# EAGLE design darwin-integrated (EAGLE 9.5.0)
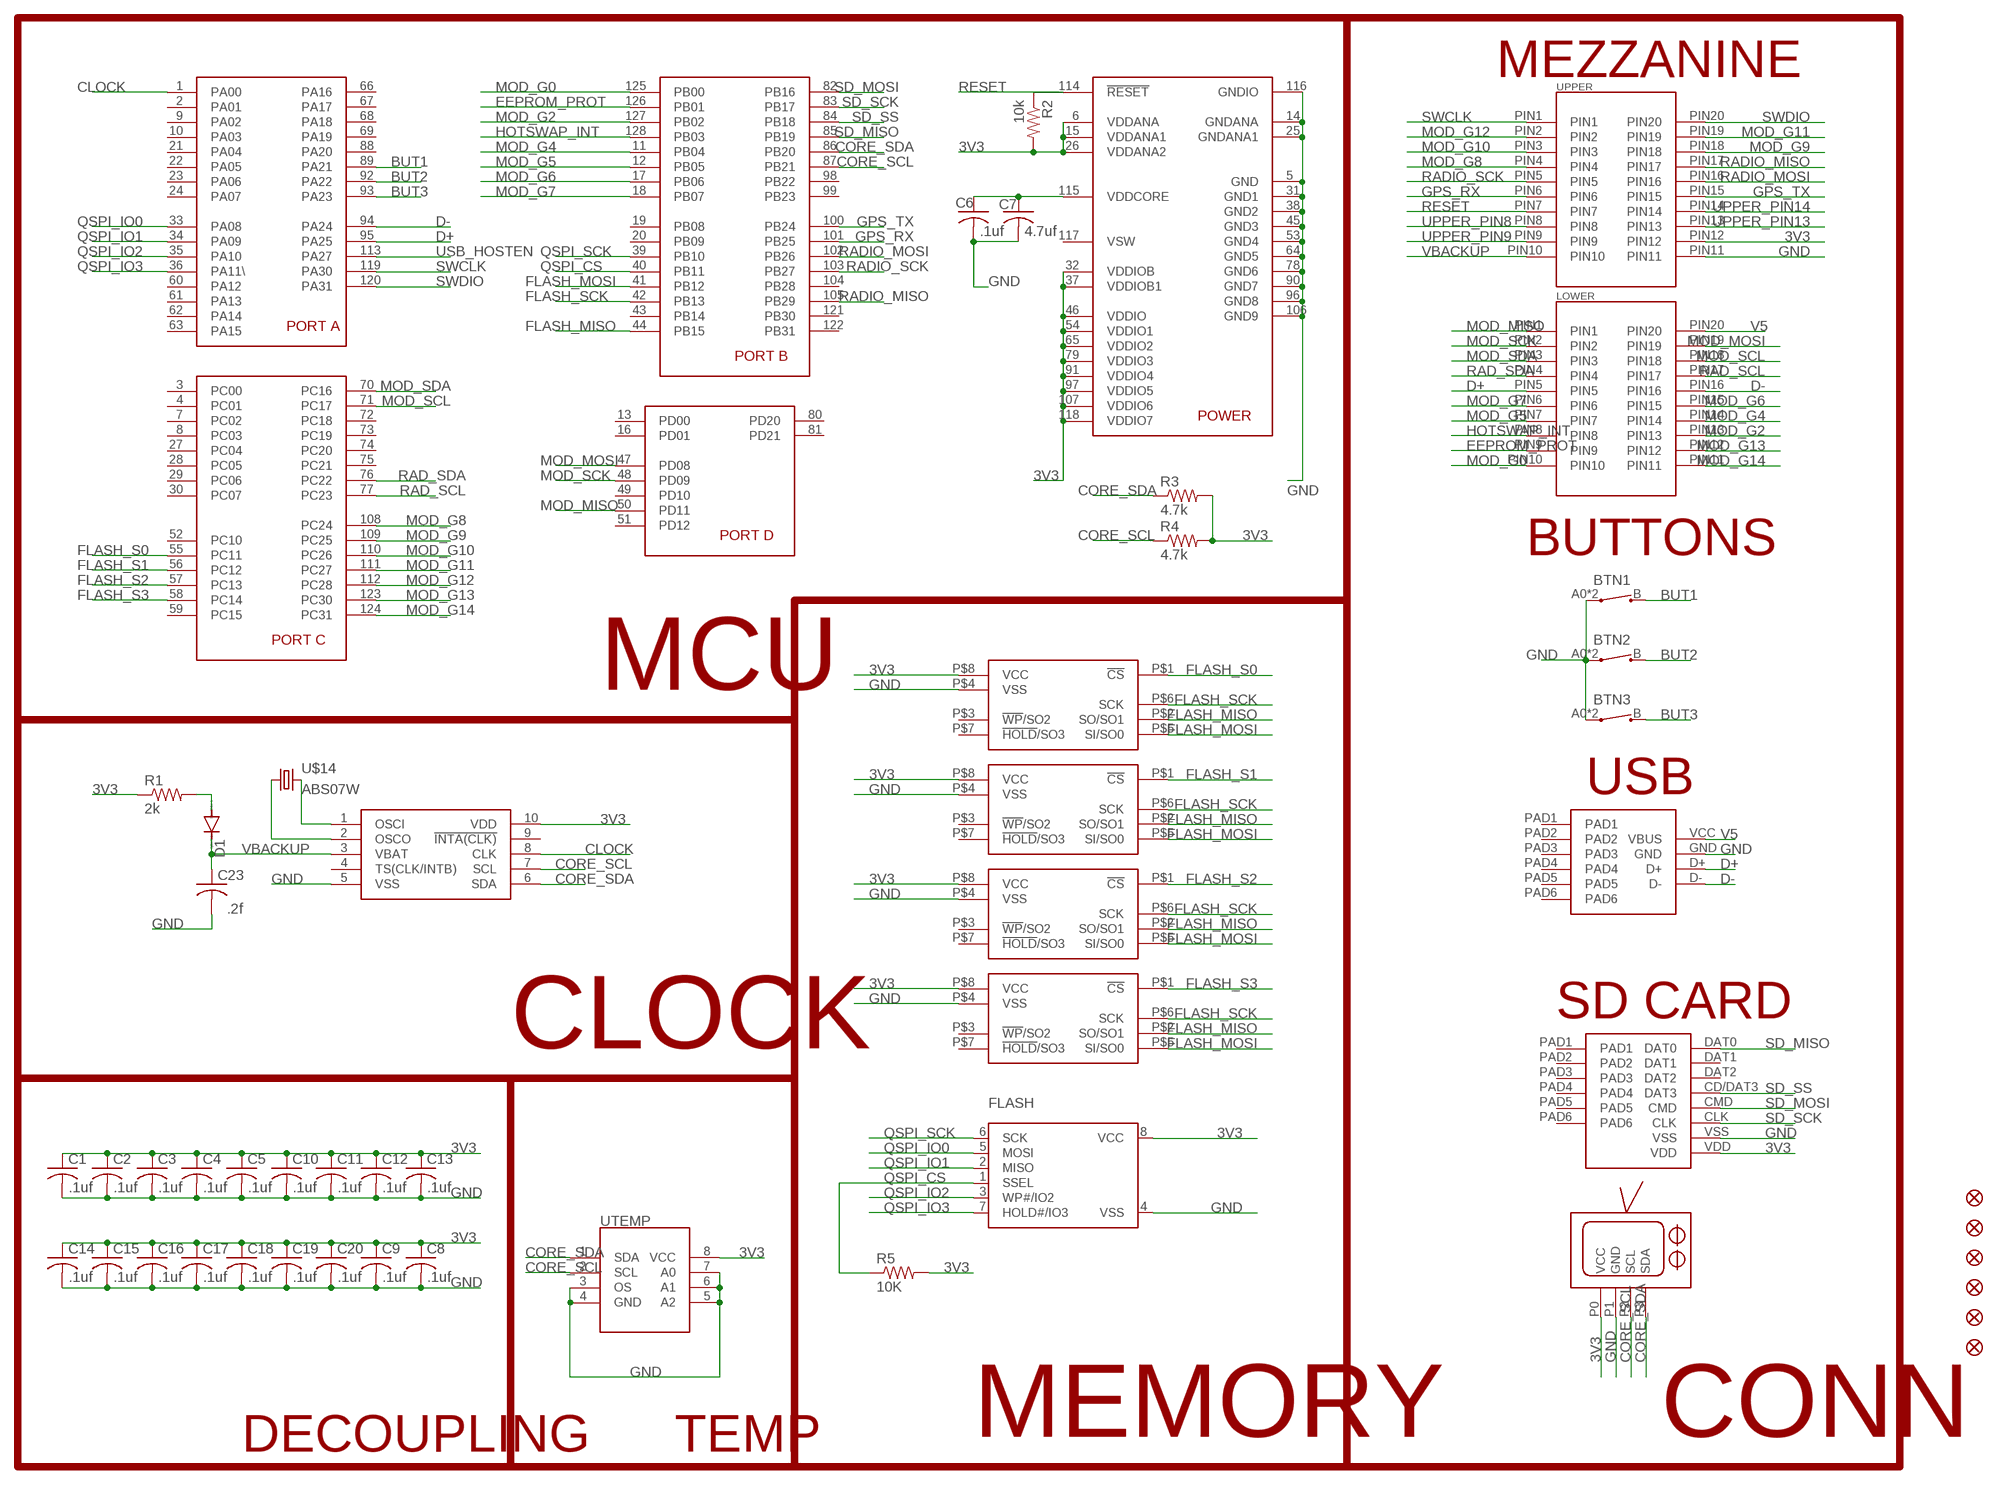
[diagram p0: schematic, sheet 1]

## Parts
BRAIN  SAMD51PXXA  [SQFP-S-14X14-128]
BTN1  EVP-AEJB2A  [EVP-AEJB2A]
BTN2  EVP-AEJB2A  [EVP-AEJB2A]
BTN3  EVP-AEJB2A  [EVP-AEJB2A]
C1  .1uf  C-USC0603K  [C0603K]
C2  .1uf  C-USC0603K  [C0603K]
C3  .1uf  C-USC0603K  [C0603K]
C4  .1uf  C-USC0603K  [C0603K]
C5  .1uf  C-USC0603K  [C0603K]
C6  .1uf  C-USC0603K  [C0603K]
C7  4.7uf  C-USC0603K  [C0603K]
C8  .1uf  C-USC0603K  [C0603K]
C9  .1uf  C-USC0603K  [C0603K]
C10  .1uf  C-USC0603K  [C0603K]
C11  .1uf  C-USC0603K  [C0603K]
C12  .1uf  C-USC0603K  [C0603K]
C13  .1uf  C-USC0603K  [C0603K]
C14  .1uf  C-USC0603K  [C0603K]
C15  .1uf  C-USC0603K  [C0603K]
C16  .1uf  C-USC0603K  [C0603K]
C17  .1uf  C-USC0603K  [C0603K]
C18  .1uf  C-USC0603K  [C0603K]
C19  .1uf  C-USC0603K  [C0603K]
C20  .1uf  C-USC0603K  [C0603K]
C23  .2f  DSK-3R3H204T614-H2L  [SUPERCAP]
D1  VS-10BQ015HM3/5BT  DIODE-SMB  [SMB]
FID1  FIDUCIAL_1MM  [FIDUCIAL_1MM]
FID2  FIDUCIAL_1MM  [FIDUCIAL_1MM]
FID3  FIDUCIAL_1MM  [FIDUCIAL_1MM]
FID4  FIDUCIAL_1MM  [FIDUCIAL_1MM]
FID5  FIDUCIAL_1MM  [FIDUCIAL_1MM]
FID6  FIDUCIAL_1MM  [FIDUCIAL_1MM]
FLASH  SPIFLASH_SOIC8208MIL  [SOIC8_208MIL]
LOWER  MOLEX-15-91-2200F  [20PH-F]
R1  2k  R-US_R0603  [R0603]
R2  10k  R-US_R0603  [R0603]
R3  4.7k  R-US_R0603  [R0603]
R4  4.7k  R-US_R0603  [R0603]
R5  10K  R-US_R0603  [R0603]
RTC  PCF85363ATT  [SOP50P490X110-10]
SCREEN  SCREEN  [SCREEN]
SD  DM3D-SF  [DM3D-SF]
U1  TC58CVG1S3HRAIG  [WSON8]
U2  TC58CVG1S3HRAIG  [WSON8]
U3  TC58CVG1S3HRAIG  [WSON8]
U4  TC58CVG1S3HRAIG  [WSON8]
U$14  ABS07W  [ABS07W]
UPPER  MOLEX-15-91-2200F  [20PH-F]
USB  MOLEX-47491-0001  [MOELX-47491-0001]
UTEMP  PCT2075  [SO8]

## Nets
3V3: BRAIN.6(VDDANA) BRAIN.15(VDDANA1) BRAIN.26(VDDANA2) BRAIN.32(VDDIOB) BRAIN.37(VDDIOB1) BRAIN.46(VDDIO) BRAIN.54(VDDIO1) BRAIN.65(VDDIO2) BRAIN.79(VDDIO3) BRAIN.91(VDDIO4) BRAIN.97(VDDIO5) BRAIN.107(VDDIO6) BRAIN.118(VDDIO7) C1.1 C2.1 C3.1 C4.1 C5.1 C8.1 C9.1 C10.1 C11.1 C12.1 C13.1 C14.1 C15.1 C16.1 C17.1 C18.1 C19.1 C20.1 FLASH.8(VCC) R1.1 R2.2 R3.2 R4.2 R5.2 RTC.10(VDD) SCREEN.P0(VCC) SD.VDD U1.P$8(VCC) U2.P$8(VCC) U3.P$8(VCC) U4.P$8(VCC) UPPER.PIN12 UTEMP.8(VCC)
BUT1: BRAIN.89(PA21) BTN1.B
BUT2: BRAIN.92(PA22) BTN2.B
BUT3: BRAIN.93(PA23) BTN3.B
CLOCK: BRAIN.1(PA00) RTC.8(CLK)
CORE_SCL: BRAIN.87(PB21) R4.1 RTC.7(SCL) SCREEN.P2(SCL) UTEMP.2(SCL)
CORE_SDA: BRAIN.86(PB20) R3.1 RTC.6(SDA) SCREEN.P3(SDA) UTEMP.1(SDA)
D+: BRAIN.95(PA25) LOWER.PIN5 USB.D+
D-: BRAIN.94(PA24) LOWER.PIN16 USB.D-
EEPROM_PROT: BRAIN.126(PB01) LOWER.PIN9
FLASH_MISO: BRAIN.44(PB15) U1.P$2(SO/SO1) U2.P$2(SO/SO1) U3.P$2(SO/SO1) U4.P$2(SO/SO1)
FLASH_MOSI: BRAIN.41(PB12) U1.P$5(SI/SO0) U2.P$5(SI/SO0) U3.P$5(SI/SO0) U4.P$5(SI/SO0)
FLASH_S0: BRAIN.55(PC11) U1.P$1(!CS)
FLASH_S1: BRAIN.56(PC12) U2.P$1(!CS)
FLASH_S2: BRAIN.57(PC13) U3.P$1(!CS)
FLASH_S3: BRAIN.58(PC14) U4.P$1(!CS)
FLASH_SCK: BRAIN.42(PB13) U1.P$6(SCK) U2.P$6(SCK) U3.P$6(SCK) U4.P$6(SCK)
GND: BRAIN.5(GND) BRAIN.14(GNDANA) BRAIN.25(GNDANA1) BRAIN.31(GND1) BRAIN.38(GND2) BRAIN.45(GND3) BRAIN.53(GND4) BRAIN.64(GND5) BRAIN.78(GND6) BRAIN.90(GND7) BRAIN.96(GND8) BRAIN.106(GND9) BRAIN.116(GNDIO) BTN1.A0 BTN1.A1 BTN2.A0 BTN2.A1 BTN3.A0 BTN3.A1 C1.2 C2.2 C3.2 C4.2 C5.2 C6.2 C7.2 C8.2 C9.2 C10.2 C11.2 C12.2 C13.2 C14.2 C15.2 C16.2 C17.2 C18.2 C19.2 C20.2 C23.- FLASH.4(VSS) RTC.5(VSS) SCREEN.P1(GND) SD.VSS U1.P$4(VSS) U2.P$4(VSS) U3.P$4(VSS) U4.P$4(VSS) UPPER.PIN11 USB.GND UTEMP.3(OS) UTEMP.4(GND) UTEMP.5(A2) UTEMP.6(A1) UTEMP.7(A0)
GPS_RX: BRAIN.101(PB25) UPPER.PIN6
GPS_TX: BRAIN.100(PB24) UPPER.PIN15
HOTSWAP_INT: BRAIN.128(PB03) LOWER.PIN8
MOD_G0: BRAIN.125(PB00) LOWER.PIN10
MOD_G2: BRAIN.127(PB02) LOWER.PIN13
MOD_G4: BRAIN.11(PB04) LOWER.PIN14
MOD_G5: BRAIN.12(PB05) LOWER.PIN7
MOD_G6: BRAIN.17(PB06) LOWER.PIN15
MOD_G7: BRAIN.18(PB07) LOWER.PIN6
MOD_G8: BRAIN.108(PC24) UPPER.PIN4
MOD_G9: BRAIN.109(PC25) UPPER.PIN18
MOD_G10: BRAIN.110(PC26) UPPER.PIN3
MOD_G11: BRAIN.111(PC27) UPPER.PIN19
MOD_G12: BRAIN.112(PC28) UPPER.PIN2
MOD_G13: BRAIN.123(PC30) LOWER.PIN12
MOD_G14: BRAIN.124(PC31) LOWER.PIN11
MOD_MISO: BRAIN.50(PD11) LOWER.PIN1
MOD_MOSI: BRAIN.47(PD08) LOWER.PIN19
MOD_SCK: BRAIN.48(PD09) LOWER.PIN2
MOD_SCL: BRAIN.71(PC17) LOWER.PIN18
MOD_SDA: BRAIN.70(PC16) LOWER.PIN3
N$2: D1.A R1.2
N$3: RTC.1(OSCI) U$14.P$2
N$4: RTC.2(OSCO) U$14.P$1
N$6: BRAIN.115(VDDCORE) C6.1 C7.1
QSPI_CS: BRAIN.40(PB11) FLASH.1(SSEL) R5.1
QSPI_IO0: BRAIN.33(PA08) FLASH.5(MOSI)
QSPI_IO1: BRAIN.34(PA09) FLASH.2(MISO)
QSPI_IO2: BRAIN.35(PA10) FLASH.3(WP#/IO2)
QSPI_IO3: BRAIN.36(PA11\) FLASH.7(HOLD#/IO3)
QSPI_SCK: BRAIN.39(PB10) FLASH.6(SCK)
RAD_SCL: BRAIN.77(PC23) LOWER.PIN17
RAD_SDA: BRAIN.76(PC22) LOWER.PIN4
RADIO_MISO: BRAIN.105(PB29) UPPER.PIN17
RADIO_MOSI: BRAIN.102(PB26) UPPER.PIN16
RADIO_SCK: BRAIN.103(PB27) UPPER.PIN5
RESET: BRAIN.114(!RESET) R2.1 UPPER.PIN7
SD_MISO: BRAIN.85(PB19) SD.DAT0
SD_MOSI: BRAIN.82(PB16) SD.CMD
SD_SCK: BRAIN.83(PB17) SD.CLK
SD_SS: BRAIN.84(PB18) SD.CD/DAT3(DAT3)
SWCLK: BRAIN.119(PA30) UPPER.PIN1
SWDIO: BRAIN.120(PA31) UPPER.PIN20
UPPER_PIN8: UPPER.PIN8
UPPER_PIN9: UPPER.PIN9
UPPER_PIN13: UPPER.PIN13
UPPER_PIN14: UPPER.PIN14
USB_HOSTEN: BRAIN.113(PA27)
V5: LOWER.PIN20 USB.VCC(VBUS)
VBACKUP: C23.+ D1.C RTC.3(VBAT) UPPER.PIN10
Unconnected: BRAIN.2(PA01) BRAIN.3(PC00) BRAIN.4(PC01) BRAIN.7(PC02) BRAIN.8(PC03) BRAIN.9(PA02) BRAIN.10(PA03) BRAIN.13(PD00) BRAIN.16(PD01) BRAIN.19(PB08) BRAIN.20(PB09) BRAIN.21(PA04) BRAIN.22(PA05) BRAIN.23(PA06) BRAIN.24(PA07) BRAIN.27(PC04) BRAIN.28(PC05) BRAIN.29(PC06) BRAIN.30(PC07) BRAIN.43(PB14) BRAIN.49(PD10) BRAIN.51(PD12) BRAIN.52(PC10) BRAIN.59(PC15) BRAIN.60(PA12) BRAIN.61(PA13) BRAIN.62(PA14) BRAIN.63(PA15) BRAIN.66(PA16) BRAIN.67(PA17) BRAIN.68(PA18) BRAIN.69(PA19) BRAIN.72(PC18) BRAIN.73(PC19) BRAIN.74(PC20) BRAIN.75(PC21) BRAIN.80(PD20) BRAIN.81(PD21) BRAIN.88(PA20) BRAIN.98(PB22) BRAIN.99(PB23) BRAIN.104(PB28) BRAIN.117(VSW) BRAIN.121(PB30) BRAIN.122(PB31) RTC.4(TS(CLK/INTB)) RTC.9(!INTA(CLK)) SD.DAT1 SD.DAT2 SD.PAD1 SD.PAD2 SD.PAD3 SD.PAD4 SD.PAD5 SD.PAD6 U1.P$3(!WP!/SO2) U1.P$7(!HOLD!/SO3) U2.P$3(!WP!/SO2) U2.P$7(!HOLD!/SO3) U3.P$3(!WP!/SO2) U3.P$7(!HOLD!/SO3) U4.P$3(!WP!/SO2) U4.P$7(!HOLD!/SO3) USB.PAD1 USB.PAD2 USB.PAD3 USB.PAD4 USB.PAD5 USB.PAD6

## Notes on the sheet
- MEZZANINE
- BUTTONS
- MCU
- USB
- .2f
- SD CARD
- CLOCK
- DECOUPLING | TEMP | MEMORY | CONN

## Library data of the parts
BRAIN = microbuilder:SAMD51PXXA: SAMD51 P variant
BTN1-BTN3 = Conservify:EVP-AEJB2A
C1-C20 = rcl:C-US: CAPACITOR, American symbol; SPICEPREFIX: C
C23 = Conservify:DSK-3R3H204T614-H2L
D1 = diode:DIODE-: DIODE
FID1-FID6 = microbuilder:FIDUCIAL: Fiducial Alignment Points Various fiducial points for machine vision alignment.; BOM: EXCLUDE
FLASH = microbuilder:SPIFLASH_SOIC8: SOIC8 SPI Flash Be careful with the size since SOIC8 flash comes in several 'widths' SOIC8 150 mil M25P16 - 16Mbit (2Mbit x 8) Serial Flash (75MHz SPI Bus), Supply: 2.7-3.6V Digikey: SOIC8 - M25P16-VMN6P-ND SOIC8 208 mil W25Q16BVSSIG - 16Mbit (2Mbit x 8) Serial Flash (104MHz SPI Bus), Supply: 2.7-3.6V Digikey: SOIC8 - W25Q16BVSSIG-ND
LOWER UPPER = Conservify:MOLEX-15-91-2200
R1-R5 = rcl:R-US_: RESISTOR, American symbol; SPICEPREFIX: R
RTC = Conservify:PCF85363ATT
SCREEN = Conservify:SCREEN
SD = Conservify:DM3D-SF
U1-U4 = Conservify:TC58CVG1S3HRAIG: Serial Interface NAND
U$14 = Conservify:ABS07W
USB = Conservify:MOLEX-47491-0001
UTEMP = Conservify:PCT2075

## Board
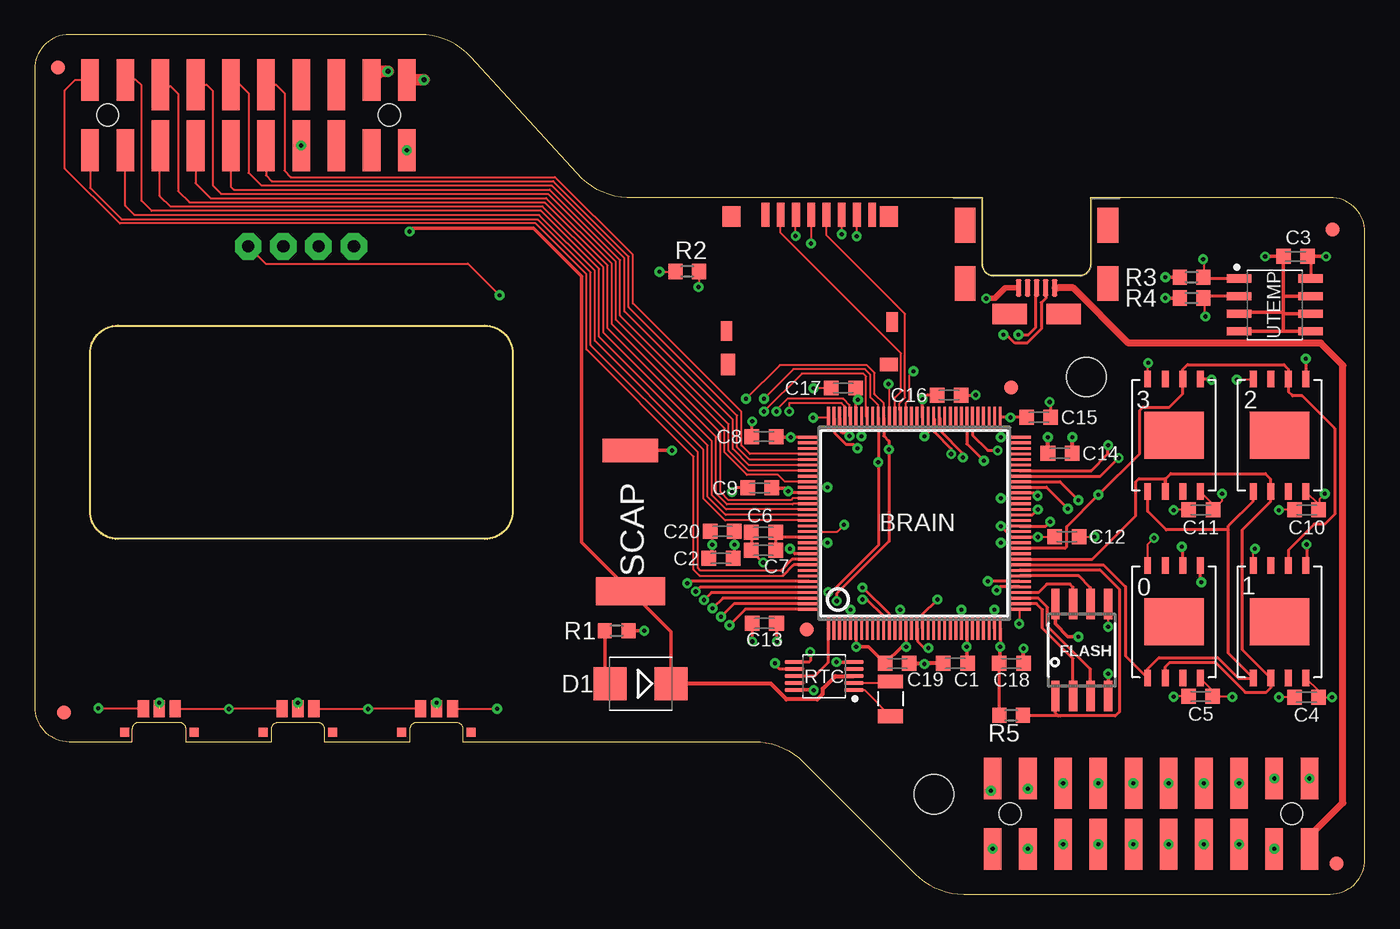
[diagram p1: board, top side]
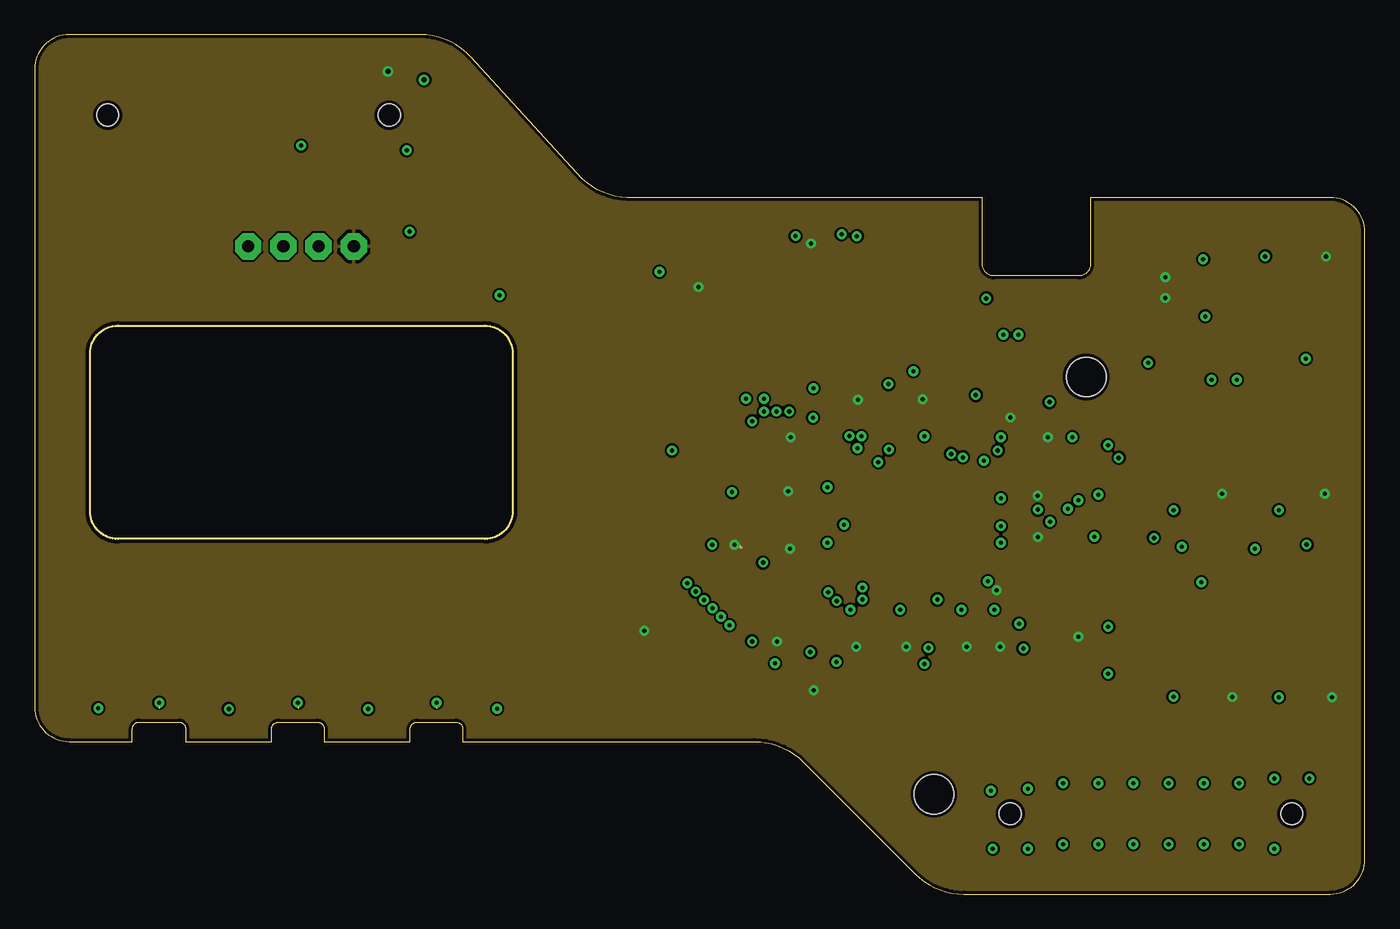
[diagram p2: board, inner layer PWR]
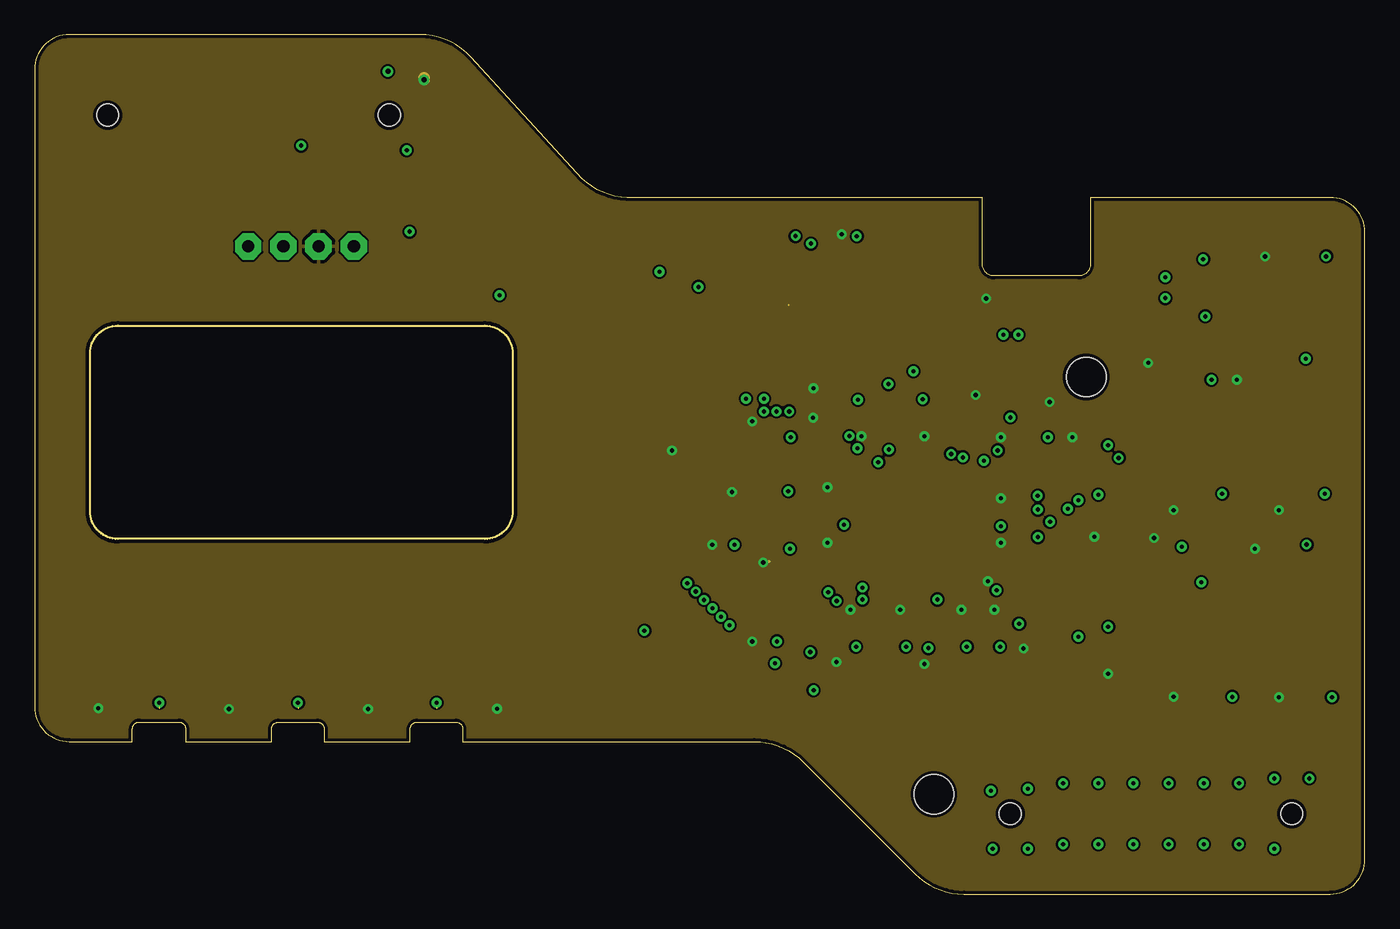
[diagram p3: board, inner layer GND]
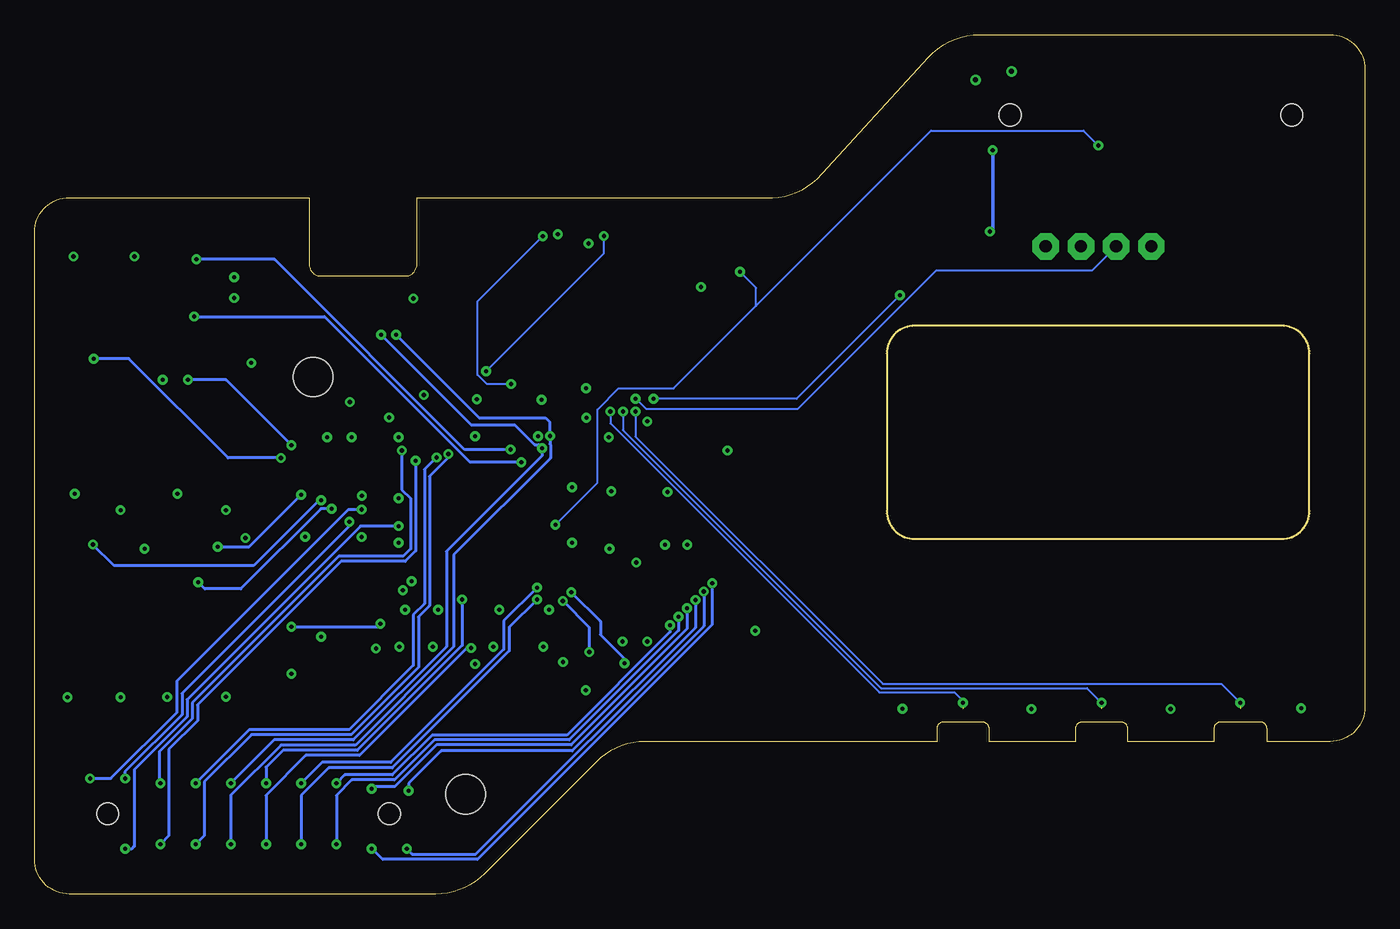
[diagram p4: board, bottom side, seen from below]

Size 96 x 62 mm. Coordinates in mm from the lower left corner, seen from the top.
Outline: 0,59.5 0,13.5 arc90 2.5,11 7.06,11 7.06,11.91 arc-90 7.56,12.41 10.4,12.41 arc-90 10.9,11.91 10.9,11 17.1,11 17.1,11.9 arc-90 17.6,12.4 20.4,12.4 arc-90 20.9,11.9 20.9,11 27.1,11 27.1,11.9 arc-90 27.6,12.4 30.4,12.4 arc-90 30.9,11.9 30.9,11 51.93,11 arc-45 55.46,9.54 63.54,1.46 arc45 67.07,0 93.5,0 arc90 96,2.5 96,47.75 arc90 93.5,50.25 76.22,50.23 76.19,50.23 76.19,45.44 arc-90 75.34,44.59 69.25,44.59 arc-90 68.4,45.44 68.4,50.25 43.2,50.25 arc-47 39.51,51.62 31.49,60.38 arc47 27.8,62 2.5,62 arc90 0,59.5
Outline: 32.5,41 arc-90 34.5,39 34.5,27.62 arc-90 32.5,25.62 6,25.62 arc-90 4,27.62 4,39 arc-90 6,41 32.5,41
Copper layers (1+2*15+16): Top 0.035mm / dielectric 1.5mm / PWR 0.035mm / dielectric 0.15mm / GND 0.035mm / dielectric 0.2mm / Bottom 0.035mm
Design rules "default *": minimum track width 6mil, minimum drill 0.3mm, track to track 6mil, track to pad 6mil, pad to pad 6mil, via to via 6mil, smd to smd 6mil, copper to edge 10mil, drill to drill 6mil, minimum pad ring 10mil, minimum via ring 8mil, stop-mask expansion 4mil, vias tented up to drill 0.31mm, thermal gap 10mil
Holes 2.84 mm at 75.9,37.3 64.9,7.2

### Footprints (pad centres in the part's own frame; a part is rotated, then mirrored left to right if it is on the bottom)
SQFP-S-14X14-128 = smd 0.2 x 1.6: 1 -6.2,-7.6; 2 -5.8,-7.6; 3 -5.4,-7.6; 4 -5,-7.6; 5 -4.6,-7.6; 6 -4.2,-7.6; 7 -3.8,-7.6; 8 -3.4,-7.6; 9 -3,-7.6; 10 -2.6,-7.6; 11 -2.2,-7.6; 12 -1.8,-7.6; 13 -1.4,-7.6; 14 -1,-7.6; 15 -0.6,-7.6; 16 -0.2,-7.6; 17 0.2,-7.6; 18 0.6,-7.6; 19 1,-7.6; 20 1.4,-7.6; 21 1.8,-7.6; 22 2.2,-7.6; 23 2.6,-7.6; 24 3,-7.6; 25 3.4,-7.6; 26 3.8,-7.6; 27 4.2,-7.6; 28 4.6,-7.6; 29 5,-7.6; 30 5.4,-7.6; 31 5.8,-7.6; 32 6.2,-7.6; 65 6.2,7.6; 66 5.8,7.6; 67 5.4,7.6; 68 5,7.6; 69 4.6,7.6; 70 4.2,7.6; 71 3.8,7.6; 72 3.4,7.6; 73 3,7.6; 74 2.6,7.6; 75 2.2,7.6; 76 1.8,7.6; 77 1.4,7.6; 78 1,7.6; 79 0.6,7.6; 80 0.2,7.6; 81 -0.2,7.6; 82 -0.6,7.6; 83 -1,7.6; 84 -1.4,7.6; 85 -1.8,7.6; 86 -2.2,7.6; 87 -2.6,7.6; 88 -3,7.6; 89 -3.4,7.6; 90 -3.8,7.6; 91 -4.2,7.6; 92 -4.6,7.6; 93 -5,7.6; 94 -5.4,7.6; 95 -5.8,7.6; 96 -6.2,7.6 | smd 1.6 x 0.2: 33 7.6,-6.2; 34 7.6,-5.8; 35 7.6,-5.4; 36 7.6,-5; 37 7.6,-4.6; 38 7.6,-4.2; 39 7.6,-3.8; 40 7.6,-3.4; 41 7.6,-3; 42 7.6,-2.6; 43 7.6,-2.2; 44 7.6,-1.8; 45 7.6,-1.4; 46 7.6,-1; 47 7.6,-0.6; 48 7.6,-0.2; 49 7.6,0.2; 50 7.6,0.6; 51 7.6,1; 52 7.6,1.4; 53 7.6,1.8; 54 7.6,2.2; 55 7.6,2.6; 56 7.6,3; 57 7.6,3.4; 58 7.6,3.8; 59 7.6,4.2; 60 7.6,4.6; 61 7.6,5; 62 7.6,5.4; 63 7.6,5.8; 64 7.6,6.2; 97 -7.6,6.2; 98 -7.6,5.8; 99 -7.6,5.4; 100 -7.6,5; 101 -7.6,4.6; 102 -7.6,4.2; 103 -7.6,3.8; 104 -7.6,3.4; 105 -7.6,3; 106 -7.6,2.6; 107 -7.6,2.2; 108 -7.6,1.8; 109 -7.6,1.4; 110 -7.6,1; 111 -7.6,0.6; 112 -7.6,0.2; 113 -7.6,-0.2; 114 -7.6,-0.6; 115 -7.6,-1; 116 -7.6,-1.4; 117 -7.6,-1.8; 118 -7.6,-2.2; 119 -7.6,-2.6; 120 -7.6,-3; 121 -7.6,-3.4; 122 -7.6,-3.8; 123 -7.6,-4.2; 124 -7.6,-4.6; 125 -7.6,-5; 126 -7.6,-5.4; 127 -7.6,-5.8; 128 -7.6,-6.2
EVP-AEJB2A = smd 0.8 x 1.25: A0 -1.15,2.375; A1 1.15,2.375; B 0,2.375 | smd 0.65 x 0.65: PAD -2.5,0.675; PAD1 2.5,0.675
C0603K = smd 1.05 x 1.08: 1 -0.875,0; 2 0.875,0
SUPERCAP = smd 5 x 2: + 0,5.15 | smd 4 x 1.7: - 0,-5
SMB = smd 2.4 x 2.4: A 2.2,0; C -2.2,0
FIDUCIAL_1MM = smd 1 x 1: 1 0,0
SOIC8_208MIL = smd 0.6 x 2.2: 1 -1.905,-3.315; 2 -0.635,-3.315; 3 0.635,-3.315; 4 1.905,-3.315; 5 1.905,3.315; 6 0.635,3.315; 7 -0.635,3.315; 8 -1.905,3.315
20PH-F = smd 3 x 1.27: PIN1 -0.34,0; PIN2 -0.34,-2.54; PIN9 -0.34,-20.32; PIN10 -0.34,-22.86; PIN11 4.74,-22.86; PIN12 4.74,-20.32; PIN19 4.74,-2.54; PIN20 4.74,0 | smd 3.68 x 1.27: PIN3 0,-5.08; PIN4 0,-7.62; PIN5 0,-10.16; PIN6 0,-12.7; PIN7 0,-15.24; PIN8 0,-17.78; PIN13 4.4,-17.78; PIN14 4.4,-15.24; PIN15 4.4,-12.7; PIN16 4.4,-10.16; PIN17 4.4,-7.62; PIN18 4.4,-5.08 | hole 1.58: 2.2,-1.27; 2.2,-21.59
R0603 = smd 1 x 1.1: 1 -0.85,0; 2 0.85,0
SOP50P490X110-10 = smd 1.438 x 0.297: 1 -2.145,1; 2 -2.145,0.5; 3 -2.145,0; 4 -2.145,-0.5; 5 -2.145,-1; 6 2.145,-1; 7 2.145,-0.5; 8 2.145,0; 9 2.145,0.5; 10 2.145,1
SCREEN = drill 0.889 pad 1.905 octagon: P0 13.97,1.27; P1 16.51,1.27; P2 19.05,1.27; P3 21.59,1.27
DM3D-SF = smd 0.55 x 1.75: CD/DAT3 6.6,-0.875; CLK 3.3,-0.875; CMD 5.5,-0.875; DAT0 1.1,-0.875; DAT1 0,-0.875; DAT2 7.7,-0.875; VDD 4.4,-0.875; VSS 2.2,-0.875 | smd 1.3 x 1.5: PAD1 -1.2,-0.75; PAD2 10.15,-0.75 | smd 0.8 x 1.4: PAD3 10.5,7.5; PAD6 -1.45,6.85 | smd 1 x 1.55: PAD4 10.4,9.925 | smd 1.3 x 1: PAD5 -1.2,9.925
WSON8 = smd 0.5 x 1.2: P$1 -1.905,-4.06; P$2 -0.635,-4.06; P$3 0.635,-4.06; P$4 1.905,-4.06; P$5 1.905,4.06; P$6 0.635,4.06; P$7 -0.635,4.06; P$8 -1.905,4.06 | smd 4.3 x 3.4: PAD 0,0
ABS07W = smd 1 x 1.8: P$1 -1.25,0; P$2 1.25,0
MOELX-47491-0001 = smd 1.25 x 0.4: D+ 0.875,0; D- 0.875,0.65; GND 0.875,-1.3; ID 0.875,-0.65; VCC 0.875,1.3 | smd 2.5 x 1.5: PAD1 -3.65,5.15; PAD2 0.55,5.15; PAD5 0.55,-5.15; PAD6 -3.65,-5.15 | smd 1.5 x 2.5: PAD3 2.75,1.95; PAD4 2.75,-1.95
SO8 = smd 1.746 x 0.592: 1 -2.585,1.905; 2 -2.585,0.635; 3 -2.585,-0.635; 4 -2.585,-1.905; 5 2.585,-1.905; 6 2.585,-0.635; 7 2.585,0.635; 8 2.585,1.905

### Placement (x,y rotation side)
BRAIN  63.48,26.75 0 top
BTN1  9,11 0 top
BTN2  19,11 0 top
BTN3  29,11 0 top
C1  66.46,16.66 180 top
C2  49.53,24.22 180 top
C3  91,46 180 top
C4  91.79,14.2 180 top
C5  84.15,14.26 180 top
C6  52.6,26.1 180 top
C7  52.6,24.8 180 top
C8  52.63,33 180 top
C9  52.33,29.3 180 top
C10  91.8,27.72 180 top
C11  84.16,27.72 180 top
C12  74.5,25.78 0 top
C13  52.66,19.54 180 top
C14  74,31.8 0 top
C15  72.46,34.4 0 top
C16  66,36 0 top
C17  58.37,36.51 180 top
C18  70.49,16.64 0 top
C19  62.25,16.64 0 top
C20  49.63,26.17 180 top
C23  43,27 180 top
D1  43.73,15.18 180 top
FID1  2.13,13.11 0 top
FID2  1.69,59.64 0 top
FID3  93.66,47.93 0 top
FID4  93.94,2.2 0 top
FID5  70.47,36.53 0 top
FID6  55.71,19.08 0 top
FLASH  75.57,17.61 0 top
LOWER  92,8 270 top
R1  42,19 180 top
R2  47.1,44.92 0 top
R3  83.5,44.5 180 top
R4  83.5,43 180 top
R5  70.48,12.89 180 top
RTC  56.98,15.73 180 top
SCREEN  37,48 180 top
SD  60.44,48.13 180 top
U1  82.23,19.64 180 top
U2  89.85,19.64 180 top
U3  89.85,33.1 180 top
U4  82.23,33.1 180 top
U$14  61.77,14.09 270 top
UPPER  4,54 90 top
USB  72.31,44.6 270 top
UTEMP  89.5,42.5 0 top

### Tracks (layer width: path | path; a pad name or v marks a point on that pad's centre or on a via)
3V3  (via drill 0.3, 0.35)
  Top 0.152: C12.1 73.6,25.75 72.39,25.75 | UTEMP.8 92,44.32 | R2.2 47.95,43.85 v47.9,43.8 | v59.42,35.67 59.24,35.85 C17.1 | 85.12,27.8 C11.1 | 91.76,15.56 U2.P$8 92.66,14.66 C4.1 v93.63,14.2 | 84.22,15.48 U1.P$8 85.02,14.69 C5.1 86.4,14.26 v86.44,14.22 | U4.P$8 85.03,28.14 C11.1 | U3.P$8 92.67,28.12 92.67,27.65 C10.1 92.72,27.76 92.72,28.47 v93.11,28.87 | C11.1 85.7,28.38 v85.7,28.87 | SD.VDD 56.04,46.95 v56.02,46.93
  Top 0.2: R5.2 69.63,16.62 C18.1 | C3.1 92.08,45.79 UTEMP.8
  Top 0.203: BRAIN.97 54.59,32.95 | v54.57,32.95 v54.56,32.95 | BRAIN.107 54.5,28.95 v54.39,29.06 | BRAIN.91 59.28,35.53 | 59.28,35.53 59.28,35.66 | 59.28,35.53 v59.42,35.67 | BRAIN.79 v64.08,35.68 v64.09,35.69 64.4,36 C16.1 | BRAIN.54 72.18,28.95 v72.39,28.74 | v72.39,25.76 72.39,25.75 BRAIN.46 | BRAIN.37 69.65,22.15 v69.42,21.92 | BRAIN.32 v69.68,17.84 | v67.27,17.84 67.28,17.85 BRAIN.26 | 62.88,17.85 v62.9,17.84 62.9,19.13 BRAIN.15 | v59.29,17.84 59.28,17.84 BRAIN.6 | C15.1 70.44,34.4 v70.42,34.39 69.72,34.39 BRAIN.65 | C13.1 53.53,18.25 v53.56,18.22 | 50.54,24.05 C2.1 50.5,24.32 v50.5,25.2 C20.1 | BRAIN.118 54.86,24.55 v54.51,24.91
  Top 0.254: RTC.10 56.2,14.73 v56.22,14.71 | R1.1 v44,19 | FLASH.8 73.67,19.49 74.58,18.57 v75.32,18.57 | C8.1 53.56,32.95 v54.57,32.95 54.59,32.95 | C9.1 53.24,29.27 54.19,29.27 v54.39,29.06 | 59.28,17.84 60.17,17.84 C19.1 62.58,17.84 v62.9,17.84 | v67.27,17.84 67.27,16.72 C1.1 | v69.68,17.84 69.68,16.7 C18.1 | C15.1 71.32,34.13 | C3.1 v93.2,46 | R3.2 v81.6,44.5 | R4.2 v81.6,43
  Top 0.305: C14.1 v73.12,32.95
  Top 0.813: UPPER.PIN12 24.93,59.35 v25.5,59.35
  PWR 0.152: v47.9,43.8 v47.9,43.81 | v86.44,14.22 86.46,14.24 | v93.63,14.2 93.89,14.2 93.93,14.24 | v93.11,28.87 v93.12,28.87
  PWR 0.203: v54.51,24.91 54.61,25.01 | v50.5,25.2 50.8,25.2 51,25
  PWR 0.254: 93.16,45.94 93.2,45.98 v93.2,46 | v81.6,44.5 81.58,44.48 81.58,44.41 | v81.6,43 81.58,43.02 81.58,43.04
  pour PWR: -3,63 100,63 100,-1 -3,-1
BUT1  (via drill 0.3)  (1 unrouted)
  Top 0.152: BRAIN.89 60.01,34.42 60.01,37.35 59.81,37.55 55.38,37.55 v52.64,34.81 | v9,13.8 9,13.5
  Bottom 0.152: v52.64,34.81 52.64,33 34.8,15.15 10.35,15.15 v9,13.8
BUT2  (via drill 0.3)  (1 unrouted)
  Top 0.152: BRAIN.92 58.81,34.42 58.81,35.28 58.36,35.73 54.33,35.73 53.55,34.95 v53.55,34.81 | v19,13.79 19,13.49
  Bottom 0.152: v53.55,34.81 53.55,33.47 34.92,14.85 20.05,14.85 v19,13.79
BUT3  (via drill 0.3)  (1 unrouted)
  Top 0.152: BRAIN.93 58.46,34.37 58.46,35.2 58.23,35.42 54.45,35.42 v54.45,34.81 | v29,13.79 29,13.49
  Bottom 0.152: v54.45,34.81 54.45,33.95 35.05,14.54 30.83,14.54 | 30.83,14.54 30.68,14.54 | 30.83,14.54 | 30.83,14.54 29.61,14.54 | 29.61,14.54 | 29.61,14.54 29,13.93 v29,13.79
CLOCK
  Top 0.203: BRAIN.1 57.25,19.15 57.25,16.69 56.28,15.73 RTC.8
CORE_SCL  (via drill 0.3)
  Top 0.152: BRAIN.87 60.88,35.26 60.31,35.83 60.31,37.48 59.93,37.86 54.76,37.86 v52.63,35.73 | v84.48,41.67 84.44,41.71 84.44,43.09
  Top 0.2: UTEMP.2 84.48,43.13 84.44,43.09 R4.1
  Top 0.203: RTC.7 53.77,16.23 53.35,16.65 v53.44,16.65 | BRAIN.87 v60.88,31.16 60.88,25.16 57.5,21.78 v57.27,21.78
  Bottom 0.152: v52.63,35.73 52.59,35.73 51.89,35.02 40.9,35.02 30.92,45 19.68,45 SCREEN.P2
  Bottom 0.203: v57.27,21.78 55.17,19.68 55.17,18.72 53.44,16.98 v53.44,16.65 | v60.88,31.16 64.58,31.16 75.08,41.66 84.47,41.66 v84.48,41.67
CORE_SDA  (via drill 0.3)
  Top 0.152: v33.55,43.2 31.27,45.48 16.66,45.48 SCREEN.P3 | BRAIN.86 61.28,35.4 60.62,36.06 60.62,37.61 60.06,38.17 53.78,38.17 v51.34,35.73 | 61.66,32.22 v61.66,32.07 | v84.33,45.79 84.38,45.73 84.38,44.47
  Top 0.2: UTEMP.1 84.44,44.41 84.38,44.47 R3.1
  Top 0.203: RTC.6 55.89,16.73 55.98,16.82 v55.98,17.46 | BRAIN.86 61.28,33.05 61.66,32.67 61.66,32.22 | v61.66,32.07 61.66,25.44 57.88,21.66 v57.88,21.14
  Bottom 0.152: v33.55,43.2 41.02,35.73 v51.34,35.73
  Bottom 0.203: v57.88,21.14 55.98,19.24 v55.98,17.46 | v61.66,32.07 64.97,32.07 78.69,45.79 v84.33,45.79
D+  (via drill 0.3)
  Top 0.203: USB.D+ 72.23,43.65 72.23,40.86 71.69,40.32 71.02,40.32 v71,40.34 | BRAIN.95 57.72,34.31 57.72,33.27 58.56,32.44 59.1,32.44 v59.38,32.16
  Bottom 0.203: v71,40.34 64.5,33.85 61.35,33.85 59.92,32.42 59.63,32.42 v59.38,32.16 59.38,31.62 66.28,24.72 66.28,17.85 73,11.12 78.72,11.12 LOWER.PIN5
  other vias: 81.84,8
D-  (via drill 0.3)
  Top 0.203: USB.D- 72.97,42.98 72.65,42.66 72.65,40.78 71.61,39.74 70.75,39.74 70.14,40.34 v69.92,40.34 | BRAIN.94 58.13,34.3 58.13,33.45 58.27,33.3 58.56,33.3 v58.81,33.04
  Bottom 0.203: v69.92,40.34 63.92,34.34 59.13,34.34 58.81,34.02 v58.81,33.04 58.81,32.46 58.77,32.42 58.77,31.46 65.75,24.48 65.75,17.85 72.85,10.75 78.23,10.75 81.84,7.14 LOWER.PIN16
  other vias: 81.84,3.6
EEPROM_PROT  (via drill 0.3)
  Top 0.203: v48.92,20.61 49.66,21.35 BRAIN.126 | v71.68,7.6 LOWER.PIN9
  Bottom 0.203: v48.92,20.61 48.92,19.12 57.28,10.76 67,10.76 69.98,7.78 71.5,7.78 v71.68,7.6
FLASH_MISO  (via drill 0.3)
  Top 0.203: BRAIN.44 74.38,24.95 74.48,25.05 74.48,26.52 v76.77,28.81 79.75,31.78 79.75,34.9 79.98,35.13 81.9,35.13 82.86,36.09 U4.P$2 82.86,37.84 83.2,38.19 90.15,38.19 90.48,37.86 U3.P$2 90.48,36.25 90.78,35.94 91.48,35.94 93.82,33.6 93.82,27.4 93.11,26.68 92.35,26.68 90.48,24.82 U2.P$2 | U1.P$2 82.86,25 v82.8,25.06
  Bottom 0.203: v82.8,25.06 80.52,25.06 v76.77,28.81
FLASH_MOSI
  Top 0.203: BRAIN.41 77.14,23.75 78.72,22.17 78.72,17.18 U1.P$5 80.32,16.24 81.14,17.06 85.38,17.06 86.87,15.58 U2.P$5 86.15,17.36 86.15,26.28 | 86.15,26.28 81.66,26.28 80.32,27.62 U4.P$5 | 86.15,26.28 86.15,26.55 87.94,28.34 U3.P$5
FLASH_S0  (via drill 0.3)
  Top 0.203: BRAIN.55 73.03,29.35 v74.57,27.8 | v84.2,22.5 84.13,22.57 U1.P$1
  Bottom 0.203: v74.57,27.8 75.33,27.8 81.12,22.01 83.71,22.01 v84.2,22.5
FLASH_S1  (via drill 0.3)
  Top 0.203: BRAIN.56 74,29.75 v75.33,28.41 | v91.79,25.21 91.79,23.74 U2.P$1
  Bottom 0.203: v75.33,28.41 75.49,28.41 80.21,23.69 90.27,23.69 v91.79,25.21
FLASH_S2  (via drill 0.3)
  Top 0.203: BRAIN.57 76.92,30.15 v78.23,31.46 | v91.74,38.62 v91.75,38.61 U3.P$1
  Bottom 0.203: v78.23,31.46 82.04,31.46 89.2,38.62 v91.74,38.62
FLASH_S3  (via drill 0.3)
  Top 0.203: BRAIN.58 76.25,30.55 77.47,31.77 v77.47,32.38 | U4.P$1 84.88,37.16 v84.94,37.1
  Bottom 0.203: v77.47,32.38 82.19,37.1 v84.94,37.1
FLASH_SCK
  Top 0.203: BRAIN.42 76.32,24.15 79.46,27.29 79.46,29.73 79.69,29.97 81.59,29.97 U4.P$6 81.59,29.93 81.98,30.33 88.82,30.33 89.21,29.93 U3.P$6 89.21,28.34 87.16,26.29 87.16,17.63 U2.P$6 89.21,14.88 88.89,14.55 87.37,14.55 85.21,16.71 81.92,16.71 81.59,16.38 U1.P$6 81.72,15.45
GND  (via drill 0.3, 0.35)
  Top 0.152: C12.2 76.47,25.78 v76.48,25.77 | BTN1.A1 13.99,13.38 | 13.99,13.38 v14.02,13.35 | BTN2.A0 13.99,13.38 | BTN2.A1 24.05,13.38 | 24.05,13.38 v24.08,13.35 | BTN3.A0 24.05,13.38 | BTN3.A1 v33.37,13.38 | BRAIN.96 v56.19,34.35 v56.18,34.36 | BTN1.A0 4.62,13.38 v4.6,13.4 | C17.2 v56.21,36.51 v56.2,36.5 | U4.P$4 80.32,38.28 v80.36,38.32 | U3.P$4 87.88,37.1 v86.76,37.1 | U2.P$4 87.94,24.78 v88.07,24.91 | U1.P$4 80.32,25.23 v80.79,25.69 | C11.2 82.22,27.72 v82.2,27.7 | C10.2 89.82,27.72 v89.8,27.7 | C4.2 v89.8,14.2 | C5.2 82.21,14.26 v82.19,14.24 | SD.VSS v58.24,47.59
  Top 0.203: BRAIN.106 57.2,29.35 v57.21,29.34 | BRAIN.90 59.68,33.03 v59.67,33.02 | BRAIN.78 64.48,33.28 v64.22,33.02 | BRAIN.64 v69.73,32.95 | BRAIN.53 v69.73,28.55 | BRAIN.45 v69.73,25.35 | BRAIN.38 v68.8,22.55 v68.79,22.56 | BRAIN.31 v69.28,20.49 v69.27,20.5 | BRAIN.25 v66.88,20.5 | BRAIN.14 62.48,20.49 v62.46,20.5 | BRAIN.5 v58.88,20.5 | BRAIN.116 v57.2,25.35 v57.21,25.35 | C15.2 73.33,35.41 v73.25,35.49 | C16.2 v67.91,36 | C8.2 51.76,34.07 v51.78,34.1 | C9.2 50.63,29.3 v50.33,29 | v51.78,18.22 | C13.2 v51.78,18.22 | v52.58,23.91 51.73,24.77 C7.2 C6.2 | C2.2 48.9,24.47 v48.9,25.2 48.9,26.02 C20.2
  Top 0.254: RTC.5 57.89,16.73 v57.87,16.74 | v46,32 C23.- | FLASH.4 v77.47,15.9 | 90.12,43.2 C3.2 v88.8,46 | 90.12,43.2 90.12,41.98 | 90.12,41.98 90.12,41.8 | 90.12,41.8 90.12,40.61 | UTEMP.4 90.11,40.59 90.12,40.61 | UTEMP.5 90.14,40.59 90.12,40.61 | UTEMP.3 87.03,41.98 90.12,41.98 | UTEMP.6 90.19,41.87 90.12,41.8 | UTEMP.7 90.19,43.13 90.12,43.2
  Top 0.305: C14.2 74.9,31.82 v74.9,32.95 | C18.2 v71.37,17.71 | C19.2 64.29,16.64 64.31,16.66 | v64.21,16.6 64.15,16.66 64.31,16.66 | C1.2 64.31,16.66
  Top 0.406: USB.GND 70.07,43.73 69.31,42.97 v68.67,42.97
  Top 0.813: UPPER.PIN11 v28.1,58.74
  GND 0.152: 54.43,42.48 54.4,42.48 | v56.18,34.36 56.21,34.36 | v56.2,36.5 56.14,36.5 56.13,36.49 | v88.07,24.91 87.98,24.91 | v80.79,25.69 80.81,25.67 80.82,25.67 | v82.2,27.7 v82.19,27.71 82.19,27.8 | v89.8,27.7 89.81,27.69 89.81,27.65 | v89.8,14.2 89.8,14.23 89.81,14.24
  GND 0.203: v52.58,23.91 52.88,23.91 52.97,24 53,24 | v48.9,25.2 49,25.1 49,25
  GND 0.254: v88.8,46 88.75,45.95 88.75,45.94
  GND 0.813: v28.1,58.74 28.1,58.89 28.09,58.89
  pour GND: -3.22,63.03 99.53,63.03 99.53,-0.66 -3.22,-0.66
GPS_RX
  Top 0.152: BRAIN.101 51.59,31.35 50.7,32.24 50.7,34.51 42.87,42.34 42.87,45.98 37.43,51.43 17.12,51.43 16.7,51.84 UPPER.PIN6
GPS_TX
  Top 0.152: BRAIN.100 51.62,31.75 51.01,32.37 51.01,34.78 43.18,42.61 43.18,46.11 37.56,51.73 18.49,51.73 18.03,52.19 18.03,57.79 17.42,58.4 UPPER.PIN15
HOTSWAP_INT  (via drill 0.3)
  Top 0.203: v50.14,19.4 51.29,20.55 BRAIN.128
  Bottom 0.203: v50.14,19.4 50.14,18.91 57.58,11.47 67.32,11.47 70.2,8.59 73.63,8.59 LOWER.PIN8
  other vias: 74.22,8
MOD_G0  (via drill 0.3)
  Top 0.203: v48.31,21.22 48.85,21.75 BRAIN.125 | v69.01,7.46 69.01,8.21 LOWER.PIN10
  Bottom 0.203: v48.31,21.22 48.31,19.23 57.21,10.33 66.67,10.33 69.01,7.99 v69.01,7.46
MOD_G2  (via drill 0.3)
  Top 0.203: v49.53,20 50.48,20.95 BRAIN.127
  Bottom 0.203: v49.53,20 49.53,19.02 57.43,11.12 67.14,11.12 70.02,8.24 73.11,8.24 74.22,7.12 LOWER.PIN13
  other vias: 74.22,3.6
MOD_G4  (via drill 0.3)
  Top 0.203: BRAIN.11 61.28,20.05 60.08,21.25 v59.75,21.25
  Bottom 0.203: v59.75,21.25 61.75,19.25 61.75,17.54 70.19,9.1 74.78,9.1 76.76,7.12 LOWER.PIN14
  other vias: 76.76,3.6
MOD_G5  (via drill 0.3)
  Top 0.203: BRAIN.12 61.68,20.22 59.79,22.11 v59.75,22.11
  Bottom 0.203: v59.75,22.11 62.15,19.71 62.15,17.66 70.31,9.5 75.26,9.5 LOWER.PIN7
  other vias: 76.76,8
MOD_G6  (via drill 0.3)
  Top 0.203: BRAIN.17 63.72,19.11 63.72,18.25 64.22,17.75 v64.5,17.75
  Bottom 0.203: v64.5,17.75 64.81,17.75 72.56,10 76.43,10 79.3,7.13 LOWER.PIN15
  other vias: 79.3,3.6
MOD_G7  (via drill 0.3)
  Top 0.203: BRAIN.18 64.08,20.19 v65.14,21.25
  Bottom 0.203: v65.14,21.25 65.14,17.94 72.71,10.38 78.08,10.38 79.3,9.16 LOWER.PIN6
  other vias: 79.3,8
MOD_G8
  Top 0.152: BRAIN.108 54.7,28.55 54.57,28.42 50.09,28.42 49.48,29.02 49.48,33.29 41.65,41.12 41.65,45.48 36.92,50.21 12.7,50.21 11.62,51.28 UPPER.PIN4
MOD_G9
  Top 0.152: BRAIN.109 54.73,28.15 54.7,28.11 49.96,28.11 49.18,28.9 49.18,32.98 41.35,40.81 41.35,45.35 36.8,49.9 11.17,49.9 10.36,50.72 10.36,57.73 9.8,58.28 9.2,58.28 UPPER.PIN18
MOD_G10
  Top 0.152: BRAIN.110 49.9,27.75 48.87,28.77 48.87,32.68 41.04,40.51 41.04,45.23 36.67,49.6 9.8,49.6 9.04,50.36 9.04,53.96 UPPER.PIN3
MOD_G11
  Top 0.152: BRAIN.111 49.86,27.35 48.57,28.65 48.57,32.38 40.74,40.2 40.74,45.1 36.55,49.29 8.43,49.29 7.71,50.01 7.71,58.33 7.3,58.74 UPPER.PIN19
MOD_G12
  Top 0.152: BRAIN.112 49.83,26.95 48.26,28.52 48.26,32.07 40.43,39.9 40.43,44.97 36.42,48.99 7.21,48.99 6.54,49.66 UPPER.PIN2
MOD_G13  (via drill 0.3)
  Top 0.203: v47.1,22.43 47.22,22.55 BRAIN.123
  Bottom 0.203: v47.1,22.43 47.1,19.43 64.03,2.5 70.88,2.5 71.68,3.3 LOWER.PIN12
  other vias: 71.68,3.26
MOD_G14  (via drill 0.3)
  Top 0.203: v47.71,21.82 48.03,22.15 BRAIN.124
  Bottom 0.203: v47.71,21.82 47.71,19.33 64.16,2.88 68.76,2.88 LOWER.PIN11
  other vias: 69.14,3.26
MOD_MISO  (via drill 0.3)
  Top 0.203: BRAIN.50 72,27.35 v72.39,27.74
  Bottom 0.152: LOWER.PIN1 92,8.25
  Bottom 0.203: v72.39,27.74 73.37,27.74 85.74,15.37 85.74,13.09 90.5,8.34 LOWER.PIN1
  other vias: 92,8.34
MOD_MOSI  (via drill 0.3)
  Top 0.203: BRAIN.47 70.12,26.15 v69.73,26.55
  Bottom 0.152: 89.5,3.25 89.49,3.26 LOWER.PIN19
  Bottom 0.203: v69.73,26.55 72.48,26.55 85,14.03 85,12.8 88.81,8.98 88.81,3.44 89,3.25 89.5,3.25
  other vias: 89.46,3.26
MOD_SCK  (via drill 0.3)
  Top 0.203: BRAIN.48 72.97,26.55 v73.28,26.86
  Bottom 0.152: 89.5,8.25 89.46,8.29 LOWER.PIN2
  Bottom 0.203: v73.28,26.86 73.28,26.56 85.37,14.48 85.37,12.95 89.5,8.81 89.5,8.25
  other vias: 89.46,8.34
MOD_SCL  (via drill 0.3)
  Top 0.203: v68.5,31.25 67.28,32.47 BRAIN.71
  Bottom 0.203: LOWER.PIN18 86.31,4.21 86.31,10.44 84.25,12.5 84.25,13.65 73.9,24 69.25,24 68.5,24.75 v68.5,31.25
  other vias: 86.92,3.6
MOD_SDA  (via drill 0.3)
  Top 0.203: BRAIN.70 67.68,33.1 68.78,32 v69.5,32
  Bottom 0.203: v69.5,32 69.5,29.18 68.87,28.55 68.87,24.9 69.39,24.37 74.05,24.37 84.62,13.8 84.62,12.65 87,10.27 87,8 LOWER.PIN3
  other vias: 86.92,8
N$2
  Top 0.254: D1.A 41.15,15.56 R1.2
N$3
  Top 0.152: RTC.1 59.88,14.73 U$14.P$2
N$4
  Top 0.152: U$14.P$1 61.66,15.23 RTC.2
N$6
  Top 0.203: BRAIN.115 53.83,25.75 C6.1 C7.1
QSPI_CS
  Top 0.152: R5.1 71.37,12.86
  Top 0.2: 74,12.86 71.37,12.86
  Top 0.203: BRAIN.40 | BRAIN.40 | BRAIN.40 76.92,23.35 78.29,21.98 78.29,13.15 77.99,12.86 74,12.86 73.87,12.86 73.67,13.06 FLASH.1
QSPI_IO0  (via drill 0.3)
  Top 0.152: BRAIN.33 71.08,19.54 v71.05,19.51 | v77.47,19.28 FLASH.5
  Bottom 0.203: v77.47,19.28 71.28,19.28 v71.05,19.51
QSPI_IO1
  Top 0.152: BRAIN.34
  Top 0.203: FLASH.2 74.94,16.99 72.74,19.18 72.74,20.52 72.31,20.95 BRAIN.34
QSPI_IO2
  Top 0.152: BRAIN.35
  Top 0.203: FLASH.3 76.2,16.23 73.1,19.33 73.1,20.69 72.43,21.36 BRAIN.35
QSPI_IO3
  Top 0.203: FLASH.7 74.94,22.14 74.72,22.35 73.04,22.35 72.44,21.75 BRAIN.36
QSPI_SCK
  Top 0.203: FLASH.6 76.2,22.11 75.36,22.96 BRAIN.39
RAD_SCL  (via drill 0.3)
  Top 0.203: BRAIN.77 64.92,34.31 64.92,33.34 66.14,32.13 v66.14,31.75
  Bottom 0.203: v66.14,31.75 66.14,31.5 | 66.14,31.5 | 66.14,31.5 67.5,30.14 67.5,20.8 68.3,20 68.3,16.35 73.15,11.5 80.36,11.5 83.76,8.09 83.76,4.22 LOWER.PIN17
  other vias: 84.38,3.6
RAD_SDA  (via drill 0.3)
  Top 0.203: BRAIN.76 65.33,34.3 65.33,33.45 67,31.77 v67,31.5 | 84.38,8.75 LOWER.PIN4
  Bottom 0.203: LOWER.PIN4 80.51,11.87 73.3,11.87 68.67,16.49 68.67,20.14 67.87,20.94 67.87,30.63 v67,31.5
  other vias: 84.38,8
RADIO_MISO
  Top 0.152: BRAIN.105 54.15,29.75 53.65,30.25 51.4,30.25 49.79,31.86 49.79,33.59 41.96,41.42 41.96,45.6 37.05,50.51 13.46,50.51 12.85,51.12 12.85,57.95 12.4,58.4 UPPER.PIN17
RADIO_MOSI
  Top 0.152: BRAIN.102 51.56,30.95 50.4,32.11 50.4,34.2 42.57,42.03 42.57,45.86 37.3,51.12 16.36,51.12 15.44,52.03 15.44,57.79 14.83,58.4 UPPER.PIN16
RADIO_SCK
  Top 0.152: BRAIN.103 51.53,30.55 50.09,31.99 50.09,33.9 42.26,41.73 42.26,45.73 37.18,50.82 14.37,50.82 14.16,51.03 UPPER.PIN5
RESET  (via drill 0.3)
  Top 0.152: BRAIN.114 57.93,26.15 v58.42,26.64 | v45.1,44.9 46.23,44.9 R2.1
  Bottom 0.152: v58.42,26.64 55.4,29.66 55.4,34.94 53.84,36.49 49.88,36.49 43.94,42.43 | 43.94,42.43 31.3,55.07 20.31,55.07 UPPER.PIN7 | 43.94,42.43 43.94,43.74 v45.1,44.9
  other vias: 19.24,54
SD_MISO  (via drill 0.3)
  Top 0.152: BRAIN.85 61.68,36.73 v61.62,36.8 | v59.33,47.46 59.33,48.87 SD.DAT0
  Bottom 0.152: v61.62,36.8 63.38,36.8 64.04,37.46 64.04,42.76 v59.33,47.46
SD_MOSI  (via drill 0.3)
  Top 0.152: BRAIN.82 62.88,35.44 63.13,35.68 63.13,37.41 v63.43,37.71 | v54.92,47.47 54.92,48.86 SD.CMD
  Bottom 0.152: v63.43,37.71 54.92,46.22 v54.92,47.47
SD_SCK
  Top 0.152: 62.41,34.97 62.41,34.94 62.48,34.87 BRAIN.83 62.41,34.97 | SD.CLK 57.14,47.54 62.82,41.85 62.82,35.81 62.41,35.4 62.41,34.97
SD_SS
  Top 0.152: 62.08,34.81 BRAIN.84 62.08,34.81 | SD.CD/DAT3 53.84,47.69 62.52,39.01 62.52,36.25 62.08,35.81 62.08,34.81
SWCLK
  Top 0.152: 53.85,23.33 48.06,23.33 47.86,23.53 47.86,31.87 40.13,39.59 40.13,44.85 36.29,48.68 6.27,48.68 4,50.95 UPPER.PIN1
  Top 0.203: BRAIN.119 54.66,24.15 53.85,23.33
SWDIO
  Top 0.152: UPPER.PIN20 2.94,58.74 2.18,57.98 2.18,52.34 6.14,48.38 36.17,48.38 39.82,44.72 39.82,39.29 47.55,31.56 47.55,23.41 47.98,22.98 54,22.98
  Top 0.203: BRAIN.120 54.77,23.75 54,22.98
V5
  Top 0.406: 73.83,43.73 USB.VCC
  Top 0.508: LOWER.PIN20 92,4.16 94.42,6.57 94.42,38.15 92.82,39.74 78.94,39.74 74.96,43.73 73.83,43.73
VBACKUP  (via drill 0.3)
  Top 0.254: 45.99,15.12 D1.C 45.93,18.92 C23.+ 39.47,25.38 39.47,44.57 36.02,48.02 27.28,48.02 v27.06,47.8
  Top 0.305: D1.C 53.12,15.18 54.25,14.05 56.49,14.05 56.88,14.44 56.88,14.82 57.78,15.73 RTC.3
  Bottom 0.254: v27.06,47.8 26.86,47.99 UPPER.PIN10
  other vias: 26.86,53.66

### Text on the board
tNames: 3 | 2 | SCAP | 0 | 1